# Altium schematic sheet Conn2&1.SchDoc
size A
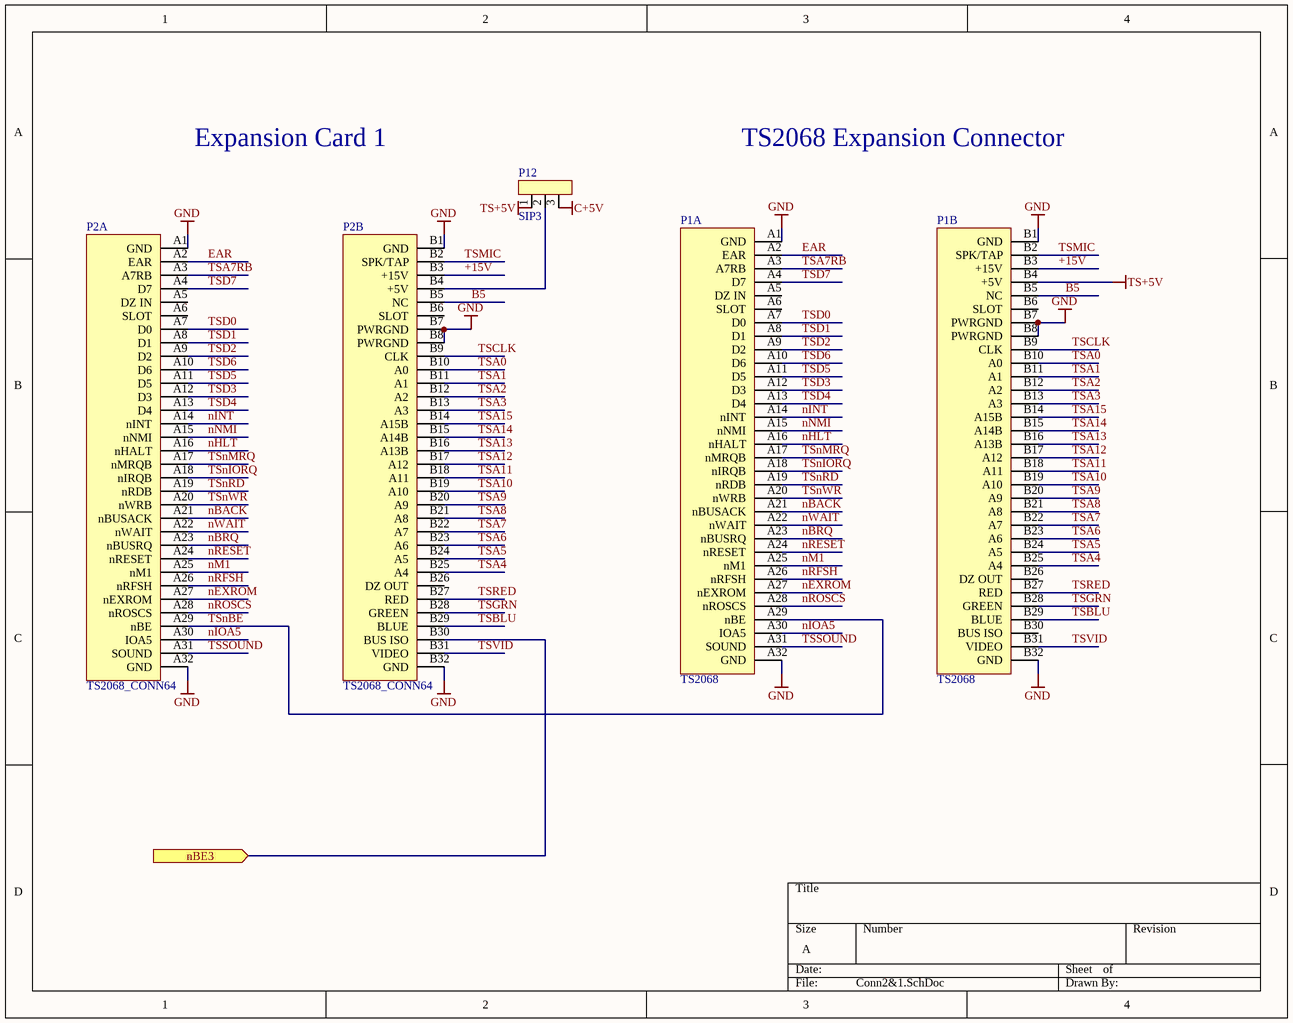
[diagram p0: Conn2&1.SchDoc]

## Parts
P1  TS2068  [TS2068]  (parts A,B of 2)
P2  TS2068_CONN64  [64CARDEDGE]  (parts A,B of 2)
P12  SIP3  [SIP3]

## Ports
nBE3 (in)

## Nets
C+5V: P12.3
GND: P1.A1(GND) P1.A32(GND) P1.B1(GND) P1.B7(PWRGND) P1.B8(PWRGND) P1.B32(GND) P2.A1(GND) P2.A32(GND) P2.B1(GND) P2.B7(PWRGND) P2.B8(PWRGND) P2.B32(GND)
TS+5V: P1.B4(+5V) P12.1
+15V: P1.B3(+15V) P2.B3(+15V)
B5: P1.B5(NC) P2.B5(NC)
EAR: P1.A2(EAR) P2.A2(EAR)
nBACK: P1.A21(nBUSACK) P2.A21(nBUSACK)
nBE3: P2.B30(BUS_ISO) ; port nBE3
nBRQ: P1.A23(nBUSRQ) P2.A23(nBUSRQ)
nEXROM: P1.A27(nEXROM) P2.A27(nEXROM)
nHLT: P1.A16(nHALT) P2.A16(nHALT)
nINT: P1.A14(nINT) P2.A14(nINT)
nIOA5: P1.A30(IOA5) P2.A30(IOA5)
nM1: P1.A25(nM1) P2.A25(nM1)
nNMI: P1.A15(nNMI) P2.A15(nNMI)
nRESET: P1.A24(nRESET) P2.A24(nRESET)
nRFSH: P1.A26(nRFSH) P2.A26(nRFSH)
nROSCS: P1.A28(nROSCS) P2.A28(nROSCS)
nWAIT: P1.A22(nWAIT) P2.A22(nWAIT)
TSA0: P1.B10(A0) P2.B10(A0)
TSA1: P1.B11(A1) P2.B11(A1)
TSA2: P1.B12(A2) P2.B12(A2)
TSA3: P1.B13(A3) P2.B13(A3)
TSA4: P1.B25(A4) P2.B25(A4)
TSA5: P1.B24(A5) P2.B24(A5)
TSA6: P1.B23(A6) P2.B23(A6)
TSA7: P1.B22(A7) P2.B22(A7)
TSA7RB: P1.A3(A7RB) P2.A3(A7RB)
TSA8: P1.B21(A8) P2.B21(A8)
TSA9: P1.B20(A9) P2.B20(A9)
TSA10: P1.B19(A10) P2.B19(A10)
TSA11: P1.B18(A11) P2.B18(A11)
TSA12: P1.B17(A12) P2.B17(A12)
TSA13: P1.B16(A13B) P2.B16(A13B)
TSA14: P1.B15(A14B) P2.B15(A14B)
TSA15: P1.B14(A15B) P2.B14(A15B)
TSBLU: P1.B29(BLUE) P2.B29(BLUE)
TSCLK: P1.B9(CLK) P2.B9(CLK)
TSD0: P1.A7(D0) P2.A7(D0)
TSD1: P1.A8(D1) P2.A8(D1)
TSD2: P1.A9(D2) P2.A9(D2)
TSD3: P1.A12(D3) P2.A12(D3)
TSD4: P1.A13(D4) P2.A13(D4)
TSD5: P1.A11(D5) P2.A11(D5)
TSD6: P1.A10(D6) P2.A10(D6)
TSD7: P1.A4(D7) P2.A4(D7)
TSGRN: P1.B28(GREEN) P2.B28(GREEN)
TSMIC: P1.B2(SPK/TAP) P2.B2(SPK/TAP)
TSnBE: P1.A29(nBE) P2.A29(nBE)
TSnIORQ: P1.A18(nIRQB) P2.A18(nIRQB)
TSnMRQ: P1.A17(nMRQB) P2.A17(nMRQB)
TSnRD: P1.A19(nRDB) P2.A19(nRDB)
TSnWR: P1.A20(nWRB) P2.A20(nWRB)
TSRED: P1.B27(RED) P2.B27(RED)
TSSOUND: P1.A31(SOUND) P2.A31(SOUND)
TSVID: P1.B31(VIDEO) P2.B31(VIDEO)
NetP2_B4: P2.B4(+5V) P12.2

Not connected (* = marked no-connect by the designer): P1 A5(DZ_IN) A6(SLOT) B6(SLOT) B26(DZ_OUT) B30(BUS_ISO); P2 A5(DZ_IN) A6(SLOT) B6(SLOT) B26(DZ_OUT)

## Notes on the sheet
- Expansion Card 1
- TS2068 Expansion Connector

## Library data of the parts
P2 = TS2068_CONN64: 64 Position Female Connector Non Specified - Dual Edge Gold 0.100" (2.54mm) Black; MFG: TD; MFG PN: 1761469-1; DK PN: 1761469-1-ND; FOOTPRINT: ESW-40; Populate: *
P1 = TS2068: Populate: *